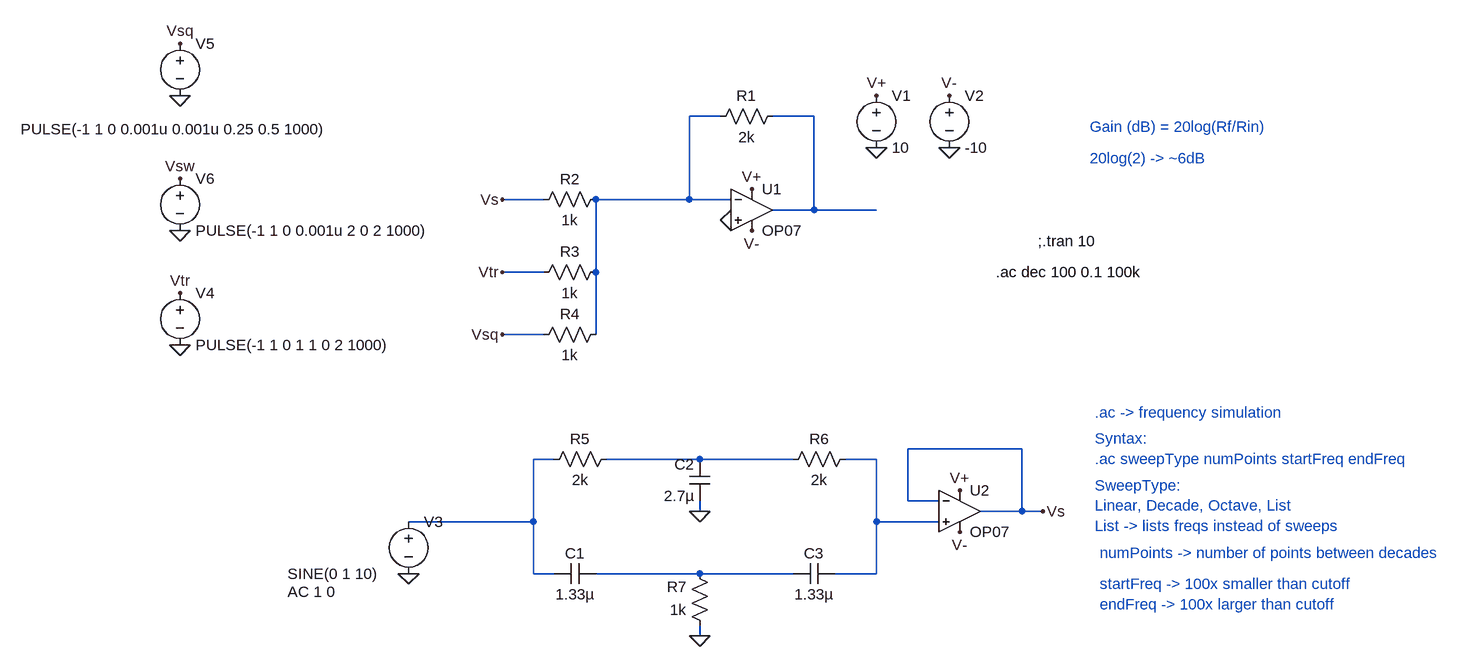
[diagram p0: schematic LTSPICE_Lesson8_Filters.asc]
LTSPICE_Lesson8_Filters.asc, the LTspice schematic file:
Version 4
SHEET 1 1784 920
WIRE 320 16 272 16
WIRE 464 16 400 16
WIRE 48 144 -16 144
WIRE 272 144 272 16
WIRE 272 144 128 144
WIRE 336 144 272 144
WIRE 464 160 464 16
WIRE 464 160 400 160
WIRE 560 160 464 160
WIRE 48 256 -16 256
WIRE 128 256 128 144
WIRE 48 352 -16 352
WIRE 128 352 128 256
WIRE 784 528 608 528
WIRE 64 544 32 544
WIRE 288 544 144 544
WIRE 432 544 288 544
WIRE 560 544 512 544
WIRE 608 608 608 528
WIRE 656 608 608 608
WIRE 288 624 288 608
WIRE 784 624 784 528
WIRE 784 624 720 624
WIRE 816 624 784 624
WIRE 32 640 32 544
WIRE 32 640 -160 640
WIRE 560 640 560 544
WIRE 656 640 560 640
WIRE 32 720 32 640
WIRE 64 720 32 720
WIRE 288 720 128 720
WIRE 432 720 288 720
WIRE 560 720 560 640
WIRE 560 720 496 720
WIRE 288 816 288 800
FLAG 336 176 0
FLAG 672 64 0
FLAG 560 64 0
FLAG 560 -16 V+
FLAG 368 128 V+
FLAG 368 192 V-
FLAG 672 -16 V-
FLAG -160 720 0
FLAG -512 368 0
FLAG -512 -16 0
FLAG -512 288 Vtr
FLAG -16 144 Vs
FLAG -16 256 Vtr
FLAG -512 -96 Vsq
FLAG -16 352 Vsq
FLAG -512 192 0
FLAG -512 112 Vsw
FLAG 288 816 0
FLAG 288 624 0
FLAG 688 592 V+
FLAG 688 656 V-
FLAG 816 624 Vs
SYMBOL OpAmps\\OP07 368 96 R0
SYMATTR InstName U1
SYMBOL res 416 0 R90
WINDOW 0 0 56 VBottom 2
WINDOW 3 32 56 VTop 2
SYMATTR InstName R1
SYMATTR Value 2k
SYMBOL res 144 128 R90
WINDOW 0 0 56 VBottom 2
WINDOW 3 32 56 VTop 2
SYMATTR InstName R2
SYMATTR Value 1k
SYMBOL res 144 240 R90
WINDOW 0 0 56 VBottom 2
WINDOW 3 32 56 VTop 2
SYMATTR InstName R3
SYMATTR Value 1k
SYMBOL res 144 336 R90
WINDOW 0 0 56 VBottom 2
WINDOW 3 32 56 VTop 2
SYMATTR InstName R4
SYMATTR Value 1k
SYMBOL voltage 560 -32 R0
WINDOW 123 0 0 Left 0
WINDOW 39 0 0 Left 0
SYMATTR InstName V1
SYMATTR Value 10
SYMBOL voltage 672 -32 R0
WINDOW 123 0 0 Left 0
WINDOW 39 0 0 Left 0
SYMATTR InstName V2
SYMATTR Value -10
SYMBOL voltage -160 624 R0
WINDOW 123 -186 124 Left 2
WINDOW 39 0 0 Left 0
WINDOW 3 -186 96 Left 2
SYMATTR Value2 AC 1 0
SYMATTR InstName V3
SYMATTR Value SINE(0 1 10)
SYMBOL voltage -512 272 R0
WINDOW 123 0 0 Left 0
WINDOW 39 0 0 Left 0
SYMATTR InstName V4
SYMATTR Value PULSE(-1 1 0 1 1 0 2 1000)
SYMBOL voltage -512 -112 R0
WINDOW 3 -245 148 Left 2
WINDOW 123 0 0 Left 0
WINDOW 39 0 0 Left 0
SYMATTR Value PULSE(-1 1 0 0.001u 0.001u 0.25 0.5 1000)
SYMATTR InstName V5
SYMBOL voltage -512 96 R0
WINDOW 123 0 0 Left 0
WINDOW 39 0 0 Left 0
SYMATTR InstName V6
SYMATTR Value PULSE(-1 1 0 0.001u 2 0 2 1000)
SYMBOL res 160 528 R90
WINDOW 0 0 56 VBottom 2
WINDOW 3 32 56 VTop 2
SYMATTR InstName R5
SYMATTR Value 2k
SYMBOL res 528 528 R90
WINDOW 0 0 56 VBottom 2
WINDOW 3 32 56 VTop 2
SYMATTR InstName R6
SYMATTR Value 2k
SYMBOL res 304 816 R180
WINDOW 0 36 76 Left 2
WINDOW 3 36 40 Left 2
SYMATTR InstName R7
SYMATTR Value 1k
SYMBOL cap 128 704 R90
WINDOW 0 0 32 VBottom 2
WINDOW 3 32 32 VTop 2
SYMATTR InstName C1
SYMATTR Value 1.33µ
SYMBOL cap 304 608 R180
WINDOW 0 24 56 Left 2
WINDOW 3 24 8 Left 2
SYMATTR InstName C2
SYMATTR Value 2.7µ
SYMBOL cap 432 736 R270
WINDOW 0 32 32 VTop 2
WINDOW 3 0 32 VBottom 2
SYMATTR InstName C3
SYMATTR Value 1.33µ
SYMBOL OpAmps\\OP07 688 560 R0
SYMATTR InstName U2
TEXT 808 208 Left 2 !;.tran 10
TEXT 744 256 Left 2 !.ac dec 100 0.1 100k
TEXT 896 472 Left 2 ;.ac -> frequency simulation
TEXT 896 512 Left 2 ;Syntax:\n.ac sweepType numPoints startFreq endFreq
TEXT 896 584 Left 2 ;SweepType: \nLinear, Decade, Octave, List \nList -> lists freqs instead of sweeps
TEXT 904 688 Left 2 ;numPoints -> number of points between decades
TEXT 904 736 Left 2 ;startFreq -> 100x smaller than cutoff\nendFreq -> 100x larger than cutoff
TEXT 888 80 Left 2 ;20log(2) -> ~6dB
TEXT 888 32 Left 2 ;Gain (dB) = 20log(Rf/Rin)

The netlist it stands for:
* LTSPICE_Lesson8_Filters.asc
XU1 0 N001 V+ V- N002 LT1001  ; OP07, pins In+ In- V+ V- OUT
R1 N002 N001 2k
R2 N001 Vs 1k
R3 N001 Vtr 1k
R4 N001 Vsq 1k
V1 V+ 0 10
V2 V- 0 -10
V3 N003 0 SINE(0 1 10) AC 1 0
V4 Vtr 0 PULSE(-1 1 0 1 1 0 2 1000)
V5 Vsq 0 PULSE(-1 1 0 0.001u 0.001u 0.25 0.5 1000)
V6 Vsw 0 PULSE(-1 1 0 0.001u 2 0 2 1000)
R5 N004 N003 2k
R6 N005 N004 2k
R7 0 N006 1k
C1 N006 N003 1.33µ
C2 0 N004 2.7µ
C3 N006 N005 1.33µ
XU2 N005 Vs V+ V- Vs LT1001  ; OP07, pins In+ In- V+ V- OUT
;.tran 10
.ac dec 100 0.1 100k
* .ac -> frequency simulation
* Syntax:
* .ac sweepType numPoints startFreq endFreq
* SweepType:
* Linear, Decade, Octave, List
* List -> lists freqs instead of sweeps
* numPoints -> number of points between decades
* startFreq -> 100x smaller than cutoff
* endFreq -> 100x larger than cutoff
* 20log(2) -> ~6dB
* Gain (dB) = 20log(Rf/Rin)
.lib LTC.lib
.backanno
.end